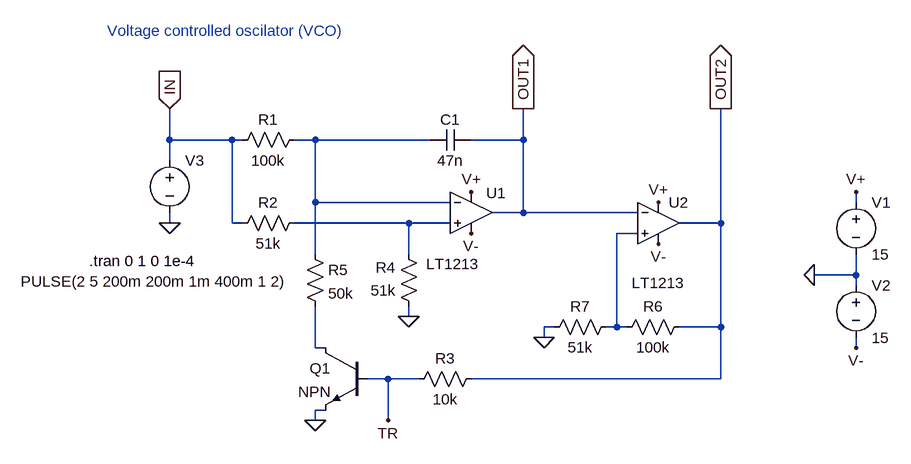
[diagram p0: schematic Voltage_controlled_oscillator.asc]
Voltage_controlled_oscillator.asc, the LTspice schematic file:
Version 4
SHEET 1 880 680
WIRE -480 -208 -480 -256
WIRE -384 -208 -480 -208
WIRE -368 -208 -384 -208
WIRE -256 -208 -288 -208
WIRE -80 -208 -256 -208
WIRE 64 -208 64 -256
WIRE 64 -208 -16 -208
WIRE -480 -176 -480 -208
WIRE -256 -112 -256 -208
WIRE -48 -112 -256 -112
WIRE 576 -112 576 -128
WIRE 64 -96 64 -208
WIRE 64 -96 16 -96
WIRE 240 -96 64 -96
WIRE -480 -80 -480 -96
WIRE -384 -80 -384 -208
WIRE -368 -80 -384 -80
WIRE -112 -80 -288 -80
WIRE -48 -80 -112 -80
WIRE 368 -80 368 -256
WIRE 368 -80 304 -80
WIRE 240 -64 208 -64
WIRE -256 -32 -256 -112
WIRE -112 -32 -112 -80
WIRE 576 0 576 -32
WIRE 576 0 512 0
WIRE 576 16 576 0
WIRE -112 64 -112 48
WIRE 112 80 96 80
WIRE 208 80 208 -64
WIRE 208 80 192 80
WIRE 224 80 208 80
WIRE 368 80 368 -80
WIRE 368 80 304 80
WIRE 96 96 96 80
WIRE -256 112 -256 48
WIRE -240 112 -256 112
WIRE 576 112 576 96
WIRE -144 160 -176 160
WIRE -96 160 -144 160
WIRE 368 160 368 80
WIRE 368 160 -16 160
WIRE -240 208 -256 208
WIRE -256 224 -256 208
WIRE -144 224 -144 160
FLAG 64 -256 OUT1
IOPIN 64 -256 Out
FLAG -480 -80 0
FLAG -480 -256 IN
IOPIN -480 -256 In
FLAG -112 64 0
FLAG -256 224 0
FLAG 96 96 0
FLAG 368 -256 OUT2
IOPIN 368 -256 Out
FLAG 512 0 0
FLAG 576 -128 V+
FLAG 576 112 V-
FLAG 272 -48 V-
FLAG -16 -64 V-
FLAG 272 -112 V+
FLAG -16 -128 V+
FLAG -144 224 TR
SYMBOL OpAmps\\LT1213 -16 -160 R0
WINDOW 0 23 34 Left 2
WINDOW 3 -69 143 Left 2
SYMATTR InstName U1
SYMBOL OpAmps\\LT1213 272 -144 R0
WINDOW 3 -41 156 Left 2
SYMATTR InstName U2
SYMBOL res -272 -224 R90
WINDOW 0 0 56 VBottom 2
WINDOW 3 32 56 VTop 2
SYMATTR InstName R1
SYMATTR Value 100k
SYMBOL res -272 -96 R90
WINDOW 0 0 56 VBottom 2
WINDOW 3 32 56 VTop 2
SYMATTR InstName R2
SYMATTR Value 51k
SYMBOL res 0 144 R90
WINDOW 0 0 56 VBottom 2
WINDOW 3 32 56 VTop 2
SYMATTR InstName R3
SYMATTR Value 10k
SYMBOL res -96 64 R180
WINDOW 0 36 76 Left 2
WINDOW 3 36 40 Left 2
SYMATTR InstName R4
SYMATTR Value 51k
SYMBOL cap -16 -224 R90
WINDOW 0 0 32 VBottom 2
WINDOW 3 32 32 VTop 2
SYMATTR InstName C1
SYMATTR Value 47n
SYMBOL voltage 576 -128 R0
WINDOW 123 0 0 Left 0
WINDOW 39 0 0 Left 0
SYMATTR InstName V1
SYMATTR Value 15
SYMBOL voltage 576 0 R0
WINDOW 3 24 97 Left 2
WINDOW 123 0 0 Left 0
WINDOW 39 0 0 Left 0
SYMATTR InstName V2
SYMATTR Value 15
SYMBOL npn -176 112 M0
SYMATTR InstName Q1
SYMBOL res -272 -48 R0
SYMATTR InstName R5
SYMATTR Value 50k
SYMBOL res 320 64 R90
WINDOW 0 0 56 VBottom 2
WINDOW 3 32 56 VTop 2
SYMATTR InstName R6
SYMATTR Value 100k
SYMBOL res 208 64 R90
WINDOW 0 0 56 VBottom 2
WINDOW 3 32 56 VTop 2
SYMATTR InstName R7
SYMATTR Value 51k
SYMBOL voltage -480 -192 R0
WINDOW 3 -229 202 Left 2
WINDOW 123 0 0 Left 0
WINDOW 39 0 0 Left 0
SYMATTR InstName V3
SYMATTR Value PULSE(2 5 200m 200m 1m 400m 1 2)
TEXT -576 -376 Left 2 ;Voltage controlled oscilator (VCO)
TEXT -604 -22 Left 2 !.tran 0 1 0 1e-4

The netlist it stands for:
* Voltage_controlled_oscillator.asc
XU1 N002 N001 V+ V- OUT1 LT1213  ; pins In+ In- V+ V- OUT
XU2 N003 OUT1 V+ V- OUT2 LT1213  ; pins In+ In- V+ V- OUT
R1 N001 IN 100k
R2 N002 IN 51k
R3 OUT2 TR 10k
R4 0 N002 51k
C1 OUT1 N001 47n
V1 V+ 0 15
V2 0 V- 15
Q1 N004 TR 0 0 NPN
R5 N001 N004 50k
R6 OUT2 N003 100k
R7 N003 0 51k
V3 IN 0 PULSE(2 5 200m 200m 1m 400m 1 2)
.model NPN NPN
.model PNP PNP
.lib standard.bjt
* Voltage controlled oscilator (VCO)
.tran 0 1 0 1e-4
.lib LTC.lib
.backanno
.end